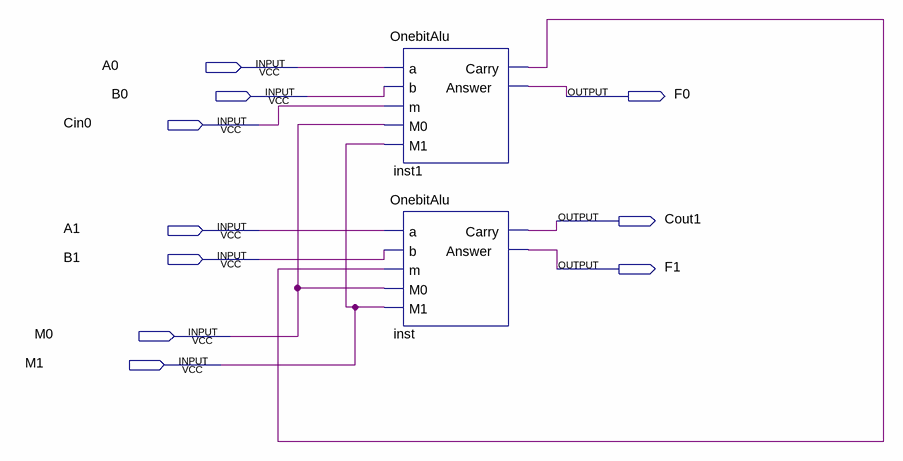
[diagram p0: schematic sheet]
// Quartus schematic fullproject.bdf as structural Verilog: 2 symbols, 10 pins
module fullproject (
  input  A0,
  input  B0,
  input  Cin0,
  input  A1,
  input  B1,
  input  M0,
  input  M1,
  output F0,
  output Cout1,
  output F1
);

  wire inst1_carry;

  OnebitAlu inst1 (.a(A0), .b(B0), .m(Cin0), .M0(M0), .M1(M1), .Carry(inst1_carry), .Answer(F0));
  OnebitAlu inst (.a(A1), .b(B1), .m(inst1_carry), .M0(M0), .M1(M1), .Carry(Cout1), .Answer(F1));
endmodule
